# Altium schematic sheet DB10005_BatteryStackMonitor.SchDoc: Battery stack monitor
size A3; SheetNumber: 2; SheetTotal: 7
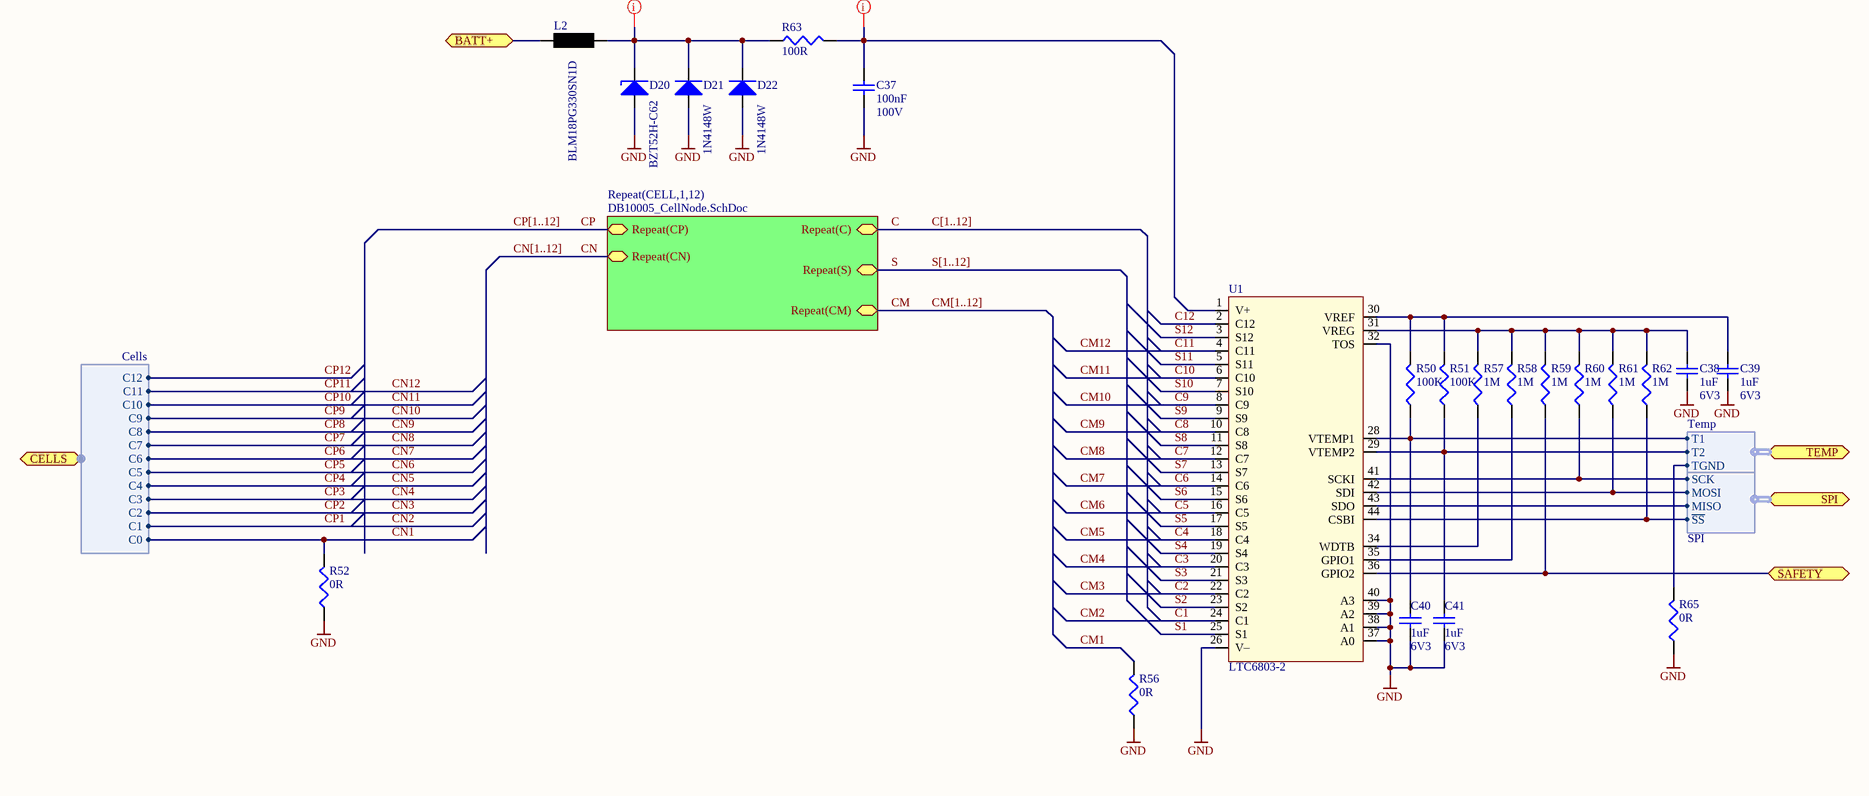
[diagram p0: DB10005_BatteryStackMonitor.SchDoc]

## Parts
C37  100nF  Voltage Rating: 100V  [C-0805]
C38  1uF  Voltage Rating: 6V3  [C0402]
C39  1uF  Voltage Rating: 6V3  [C0402]
C40  1uF  Voltage Rating: 6V3  [C0402]
C41  1uF  Voltage Rating: 6V3  [C0402]
D20  BZT52H-C62  [SOD123W]
D21  1N4148W  [SOD123]
D22  1N4148W  [SOD123]
L2  BLM18PG330SN1D  [L0603]
R50  100K  [0402]
R51  100K  [0402]
R52  0R  [0603]
R56  0R  [0603]
R57  1M  [0402]
R58  1M  [0402]
R59  1M  [0402]
R60  1M  [0402]
R61  1M  [0402]
R62  1M  [0402]
R63  100R  [0603]
R65  0R  [0603]
U1  LTC6803-2  [SSOP44]

## Sub-sheets
Repeat(CELL,1,12) = DB10005_CellNode.SchDoc: Repeat(CN), Repeat(CP), Repeat(S), Repeat(C), Repeat(CM)

## Ports
BATT+, CELLS (harness Cells), SAFETY, SPI (harness SPI), TEMP (harness Temp)

## Harnesses
SPI: ~{SS}, SCK, MISO, MOSI
Cells: C1, C9, C2, C3, C4, C5, C6, C7, C8, C10, C11, C0, C12
Temp: T1, T2, TGND

## Nets
GND: C37.1 C38.1 C39.1 C40.1 C41.1 D20.1 D21.1(A) D22.1(A) R52.1 R56.1 R65.1 U1.26(V–) U1.32(TOS) U1.37(A0) U1.38(A1) U1.39(A2) U1.40(A3)
BATT+: L2.1 ; port BATT+
C: sheet Repeat(CELL,1,12)/Repeat(C)
C1: U1.24(C1)  [also labelled CM2]
C2: U1.22(C2)  [also labelled CM3]
C3: U1.20(C3)  [also labelled CM4]
C4: U1.18(C4)  [also labelled CM5]
C5: U1.16(C5)  [also labelled CM6]
C6: U1.14(C6)  [also labelled CM7]
C7: U1.12(C7)  [also labelled CM8]
C8: U1.10(C8)  [also labelled CM9]
C9: U1.8(C9)  [also labelled CM10]
C10: U1.6(C10)  [also labelled CM11]
C11: U1.4(C11)  [also labelled CM12]
C12: U1.2(C12)
CM: sheet Repeat(CELL,1,12)/Repeat(CM)
CM1: R56.2
CN: sheet Repeat(CELL,1,12)/Repeat(CN)
CN1: R52.2 ; port CELLS.C0
CN2: port CELLS.C1  [also labelled CP1]
CN3: port CELLS.C2  [also labelled CP2]
CN4: port CELLS.C3  [also labelled CP3]
CN5: port CELLS.C4  [also labelled CP4]
CN6: port CELLS.C5  [also labelled CP5]
CN7: port CELLS.C6  [also labelled CP6]
CN8: port CELLS.C7  [also labelled CP7]
CN9: port CELLS.C8  [also labelled CP8]
CN10: port CELLS.C9  [also labelled CP9]
CN11: port CELLS.C10  [also labelled CP10]
CN12: port CELLS.C11  [also labelled CP11]
CP: sheet Repeat(CELL,1,12)/Repeat(CP)
CP12: port CELLS.C12
S: sheet Repeat(CELL,1,12)/Repeat(S)
S1: U1.25(S1)
S2: U1.23(S2)
S3: U1.21(S3)
S4: U1.19(S4)
S5: U1.17(S5)
S6: U1.15(S6)
S7: U1.13(S7)
S8: U1.11(S8)
S9: U1.9(S9)
S10: U1.7(S10)
S11: U1.5(S11)
S12: U1.3(S12)
SAFETY: R59.1 U1.36(GPIO2) ; port SAFETY
NetC37_2: C37.2 R63.2 U1.1(V+)
NetC38_2: C38.2 R57.2 R58.2 R59.2 R60.2 R61.2 R62.2 U1.31(VREG)
NetC39_2: C39.2 R50.2 R51.2 U1.30(VREF)
NetC40_2: C40.2 R50.1 U1.28(VTEMP1) ; port TEMP.T1
NetC41_2: C41.2 R51.1 U1.29(VTEMP2) ; port TEMP.T2
NetD20_2: D20.2 D21.2(K) D22.2(K) L2.2 R63.1
NetR57_1: R57.1 U1.34(WDTB)
NetR58_1: R58.1 U1.35(GPIO1)
NetR60_1: R60.1 U1.41(SCKI) ; port SPI.SCK
NetR61_1: R61.1 U1.42(SDI) ; port SPI.MOSI
NetR62_1: R62.1 U1.44(CSBI) ; port SPI.~{SS}
NetR65_2: R65.2 ; port TEMP.TGND
NetU1_43: U1.43(SDO) ; port SPI.MISO

## Buses and harness runs
bus C[1..12]
bus CM[1..12]
bus CN[1..12]
bus CP[1..12]
bus S[1..12]

## Layout directives
net class CELL: NetC37_2, NetD20_2

## Notes on the sheet
- Title
- Size:
- Date:
- A3
- Number:
- Time:
- Revision:
- Sheet
- of
- File:

## Library data of the parts
C37 = 100nF/0805/CER/100V: Capacitor, 100nF, 100V, X7R; Capacitance Tolerance: ± 10%; Capacitor Case Style: 0805; Brand Number: C0805C104K1RACTU; Brand: KEMET; Dielectric Characteristic: X7R; Capacitance: 100nF; Temperature Range: -55°C to +125°C; Price: 0,096; Order Code Supplier: 1650862; Supplier: Farnell
C38-C41 = 1uF/0402/CER/6.3V: Capacitor, 1uF, 6.3V, X5R; Capacitance Tolerance: ± 10%; Capacitor Case Style: 0402; Brand Number: 04026D105KAT2A; Brand: AVX; Dielectric Characteristic: X5R; Capacitance: 1uF; Temperature Range: -55°C to +85°C; Price: 0,0874; Order Code Supplier: 1327658; Supplier: Farnell
D20 = BZT52H-C62,115: Diode Zener, Vz: 62V, If: 0.25A, Vf: 0.9V; Brand: NXP; Case Style: SOD-123F; Brand Number: BZT52H-C62,115; Forward Current: 0.25A; Forward Voltage: 0.9V; Order Code Supplier: 1757813RL; Price: 0,053; Supplier: Farnell; Temperature Range: -65°C to +150°C; Zener Voltage: 62V
D21 D22 = MMSD4148T1G: Diode, Vrrm: 100V, If: 0.15A, Vf: 1V; Brand: ON SEMICONDUCTOR; Case Style: SOD-123; Forward Current: 0.2A; Brand Number: MMSD4148T1G; Forward Voltage: 1V; Order Code Supplier: 9556079; Price: 0,19; Supplier: Farnell; Temperature Range: -65°C to +150°C; Vrrm: 100V
L2 = BLM18PG330SN1D: Ferrite Bead, Impedance:33ohm, DC Resistance Max:0.025ohm, DC Current Rating:3A; Brand: MURATA; Case Style: 0603; Brand Number: BLM18PG330SN1D; Price: 0,048; Supplier: Farnell; Order Code Supplier: 1515742
R50 R51 = 100k/0402/0063W/50V: Resistor, 100k, 0.1%, 0.0625W, 50V, 100PPM, 0402; Brand: VISHAY DRALORIC; Brand Number: CRCW0402100KFKED; Power Rating: 0.063W; Case Style: 0402; Order Code Supplier: 2121857; Price: 0,0004; Resistance: 100K; Supplier: Farnell; Temperature Coefficient: ± 100PPM; Temperature Range: -55°C to +125°C; Voltage Rating: 50V
R52 R56 R65 = 0/0603/0063W/50V: Resistor, 0R, 0.1%, 0.063W, 50V, 200PPM, 0603; Brand: VISHAY DRALORIC; Brand Number: CRCW06030000Z0EA; Case Style: 0603; Order Code Supplier: 2122112; Power Rating: 0.063W; Price: 0,043; Resistance: 0R; Supplier: Farnell; Temperature Coefficient: ± 200PPM; Temperature Range: -55°C to +125°C; Voltage Rating: 50V
R57-R62 = 1M/0402/0063W/50V: Resistor, 1M, 0.1%, 0.0625W, 50V, 100PPM, 0402; Brand: VISHAY DRALORIC; Brand Number: CRCW04021M00FKED; Power Rating: 0.063W; Case Style: 0402; Order Code Supplier: 2121984; Price: 0,0006; Resistance: 1M; Supplier: Farnell; Temperature Coefficient: ± 100PPM; Temperature Range: -55°C to +125°C; Voltage Rating: 50V
R63 = 100/0603/0063W/50V: Resistor, 100R, 1%, 0.063W, 50V, 200PPM, 0603; Brand: VISHAY DRALORIC; Brand Number: CRCW0603100RFKEA; Case Style: 0603; Order Code Supplier: 2122239; Power Rating: 0.063W; Price: 0,007; Resistance: 100R; Supplier: Farnell; Temperature Coefficient: ± 200PPM; Temperature Range: -55°C to +125°C; Voltage Rating: 50V
U1 = LTC6803-2: Multicell Battery Stack Monitor, T:-40°C to +85°C; Brand Number: LTC6803IG-2#PBF; Brand: Linear Technology; Case Style: SSOP-44; Price: 14,08; Supplier: RS-Online; Temperature Range: -40°C to 85°C; Order Code Supplier: 858-0829